# EAGLE design Driver Mosfet (EAGLE 5.08)
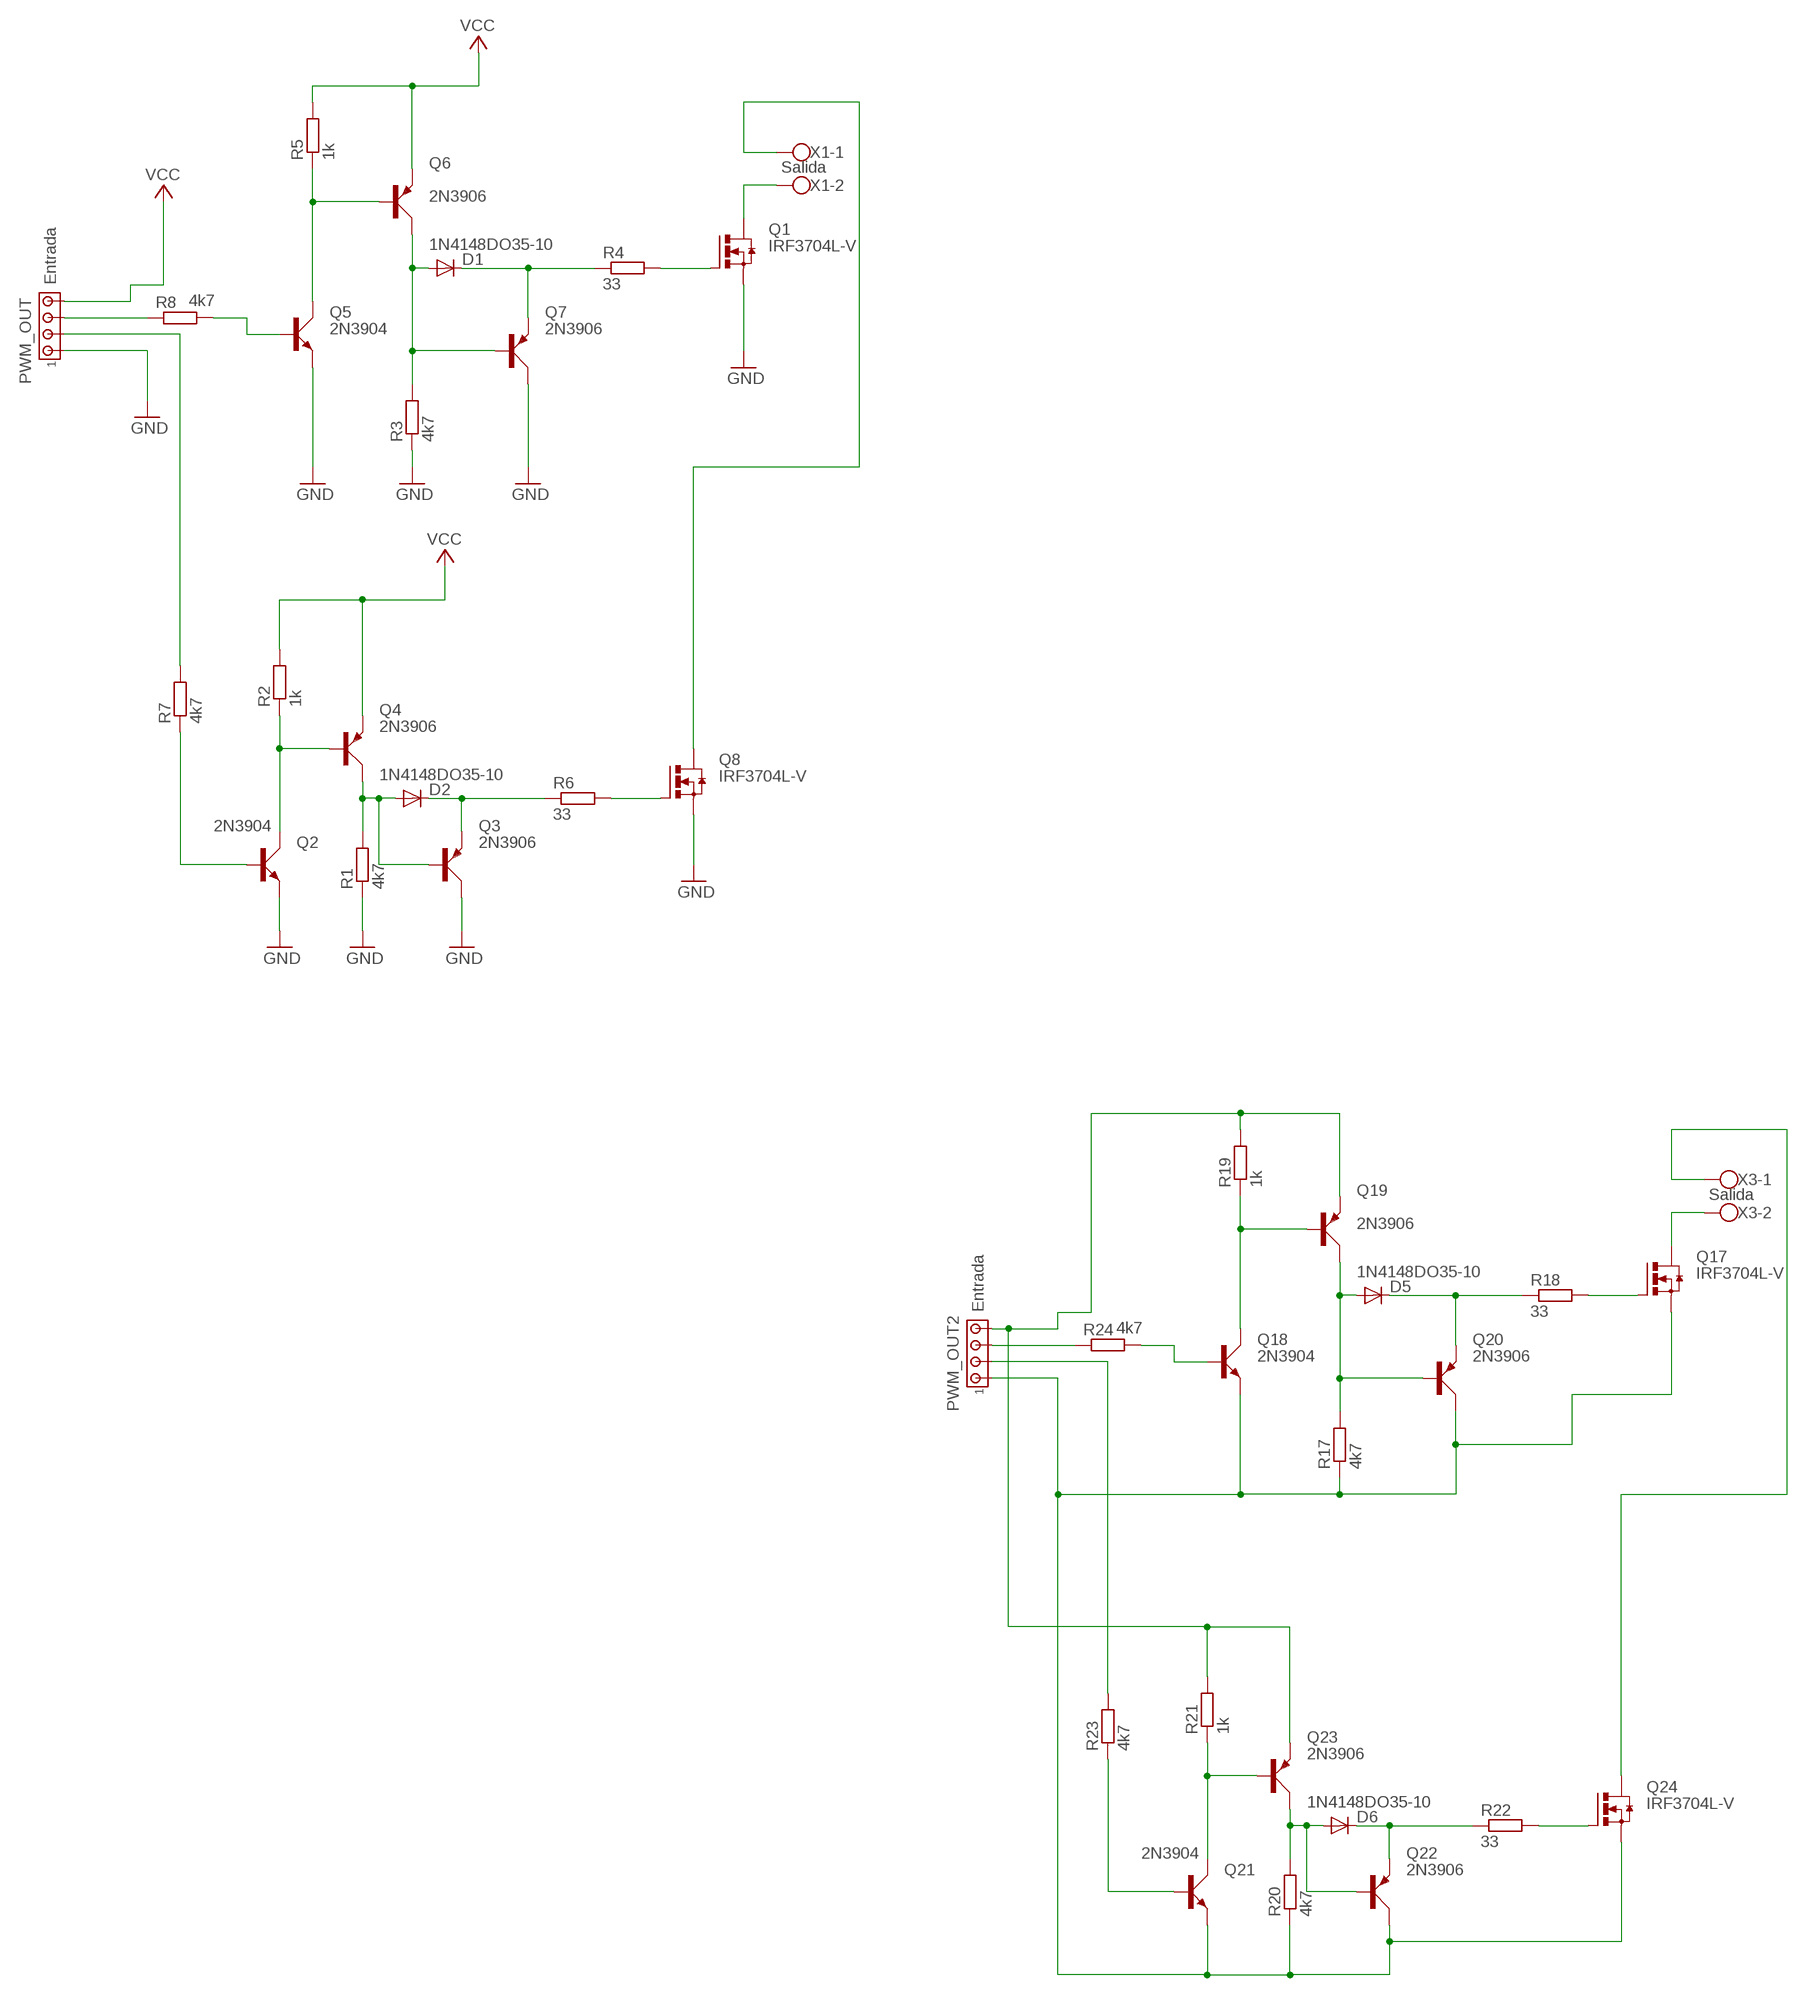
[diagram p0: schematic, sheet 1]

## Parts
D1  1N4148DO35-10  [DO35-10]
D2  1N4148DO35-10  [DO35-10]
D5  1N4148DO35-10  [DO35-10]
D6  1N4148DO35-10  [DO35-10]
PWM_OUT  Entrada  MTA04-100  [10X04MTA]
PWM_OUT2  Entrada  MTA04-100  [10X04MTA]
Q1  IRF3704L-V  [TO262-V]
Q2  2N3904  [TO92D]
Q3  2N3906  [TO92D]
Q4  2N3906  [TO92D]
Q5  2N3904  [TO92D]
Q6  2N3906  [TO92D]
Q7  2N3906  [TO92D]
Q8  IRF3704L-V  [TO262-V]
Q17  IRF3704L-V  [TO262-V]
Q18  2N3904  [TO92D]
Q19  2N3906  [TO92D]
Q20  2N3906  [TO92D]
Q21  2N3904  [TO92D]
Q22  2N3906  [TO92D]
Q23  2N3906  [TO92D]
Q24  IRF3704L-V  [TO262-V]
R1  4k7  R-EU_0207/7  [0207/7]
R2  1k  R-EU_0207/7  [0207/7]
R3  4k7  R-EU_0207/7  [0207/7]
R4  33  R-EU_0207/7  [0207/7]
R5  1k  R-EU_0207/7  [0207/7]
R6  33  R-EU_0207/7  [0207/7]
R7  4k7  R-EU_0207/7  [0207/7]
R8  4k7  R-EU_0207/7  [0207/7]
R17  4k7  R-EU_0207/7  [0207/7]
R18  33  R-EU_0207/7  [0207/7]
R19  1k  R-EU_0207/7  [0207/7]
R20  4k7  R-EU_0207/7  [0207/7]
R21  1k  R-EU_0207/7  [0207/7]
R22  33  R-EU_0207/7  [0207/7]
R23  4k7  R-EU_0207/7  [0207/7]
R24  4k7  R-EU_0207/7  [0207/7]
X1  Salida  W237-02P  [W237-132]
X3  Salida  W237-02P  [W237-132]

## Nets
GND: PWM_OUT.1 Q1.3(S) Q2.E Q3.C Q5.E Q7.C Q8.3(S) R1.1 R3.1
N$1: PWM_OUT.2 R7.2
N$2: Q5.B R8.2
N$3: Q5.C Q6.B R5.1
N$4: D1.A Q6.C Q7.B R3.2
N$5: Q2.C Q4.B R2.1
N$6: D1.C Q7.E R4.1
N$7: Q1.1(G) R4.2
N$8: Q8.2(D) X1.1
N$9: D2.C Q3.E R6.1
N$10: Q8.1(G) R6.2
N$11: Q2.B R7.1
N$12: PWM_OUT.3 R8.1
N$13: D2.A Q3.B Q4.C R1.2
N$14: Q1.2(D) X1.2
N$29: Q18.C Q19.B R19.1
N$30: D5.A Q19.C Q20.B R17.2
N$31: D5.C Q20.E R18.1
N$32: Q17.1(G) R18.2
N$33: Q21.C Q23.B R21.1
N$34: D6.C Q22.E R22.1
N$35: Q24.1(G) R22.2
N$36: PWM_OUT2.2 R23.2
N$37: Q18.B R24.2
N$38: Q21.B R23.1
N$39: PWM_OUT2.3 R24.1
N$40: D6.A Q22.B Q23.C R20.2
N$41: Q24.2(D) X3.1
N$42: Q17.2(D) X3.2
N$45: PWM_OUT2.1 Q17.3(S) Q18.E Q20.C Q21.E Q22.C Q24.3(S) R17.1 R20.1
N$46: PWM_OUT2.4 Q19.E Q23.E R19.2 R21.2
VCC: PWM_OUT.4 Q4.E Q6.E R2.2 R5.2

## Library data of the parts
D1 D2 D5 D6 = diode:1N4148: DIODE high speed (Philips)
PWM_OUT PWM_OUT2 = con-amp:MTA04-100: AMP connector
Q1 Q8 Q17 Q24 = transistor-power:IRF3704: SMPS MOSFET HEXFET® Power MOSFET Source: http://www.irf.com/product-info/datasheets/data/irf3704.pdf
Q2 Q5 Q18 Q21 = transistor-small-signal:2N3904: NPN TRANSISTOR
Q3 Q4 Q6 Q7 Q19 Q20 Q22 Q23 = transistor-small-signal:2N3906: PNP TRANSISTOR
R1-R8 R17-R24 = rcl:R-EU_: RESISTOR, European symbol
X1 X3 = con-wago-508:W237-02P: WAGO SREW CLAMP

## Board
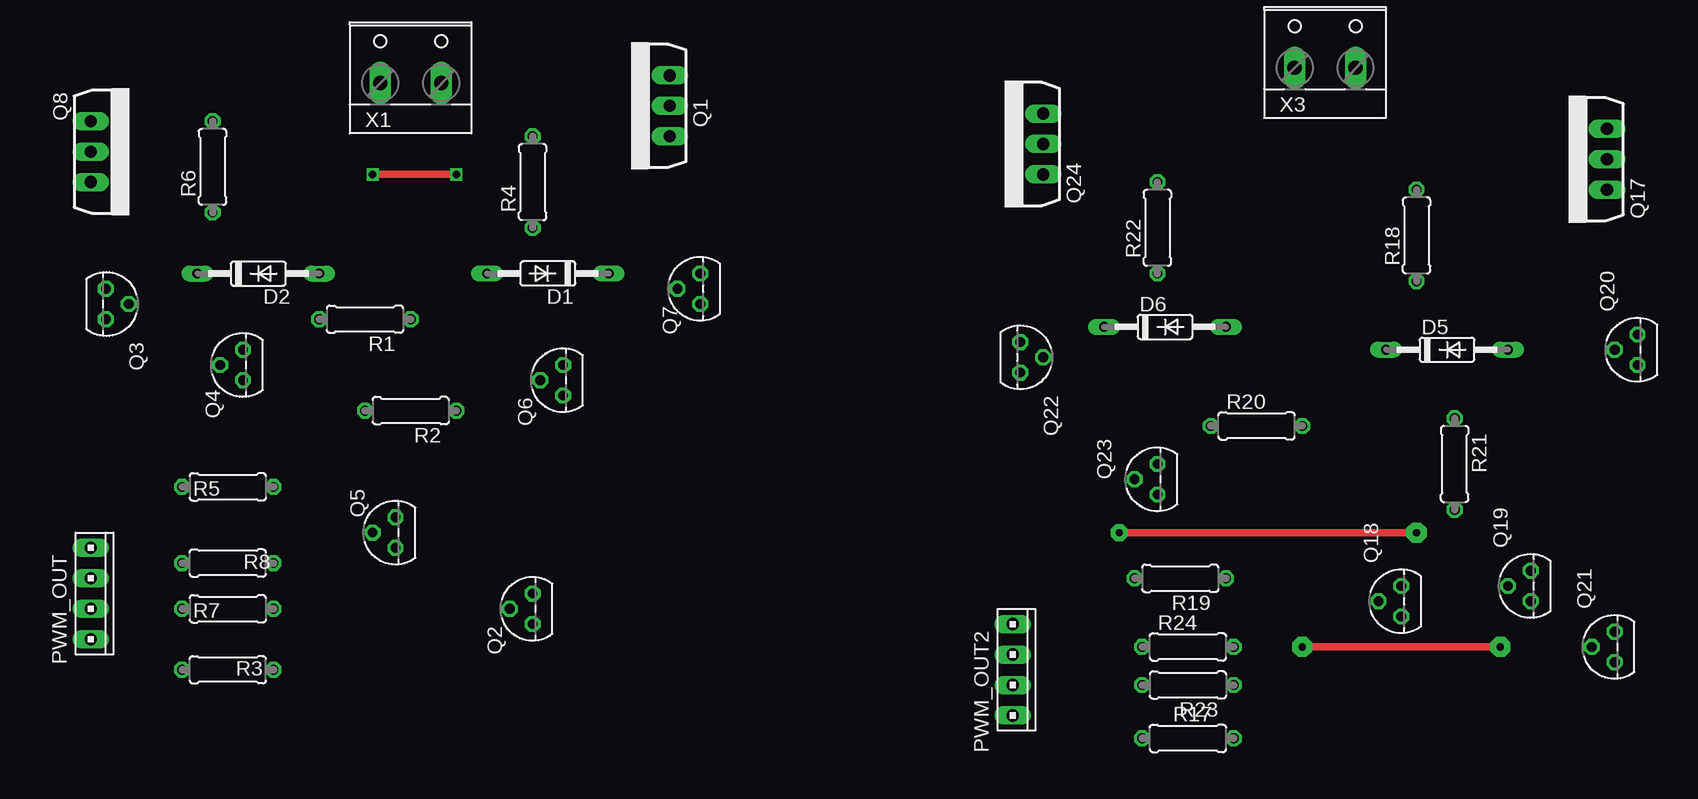
[diagram p1: board, top side]
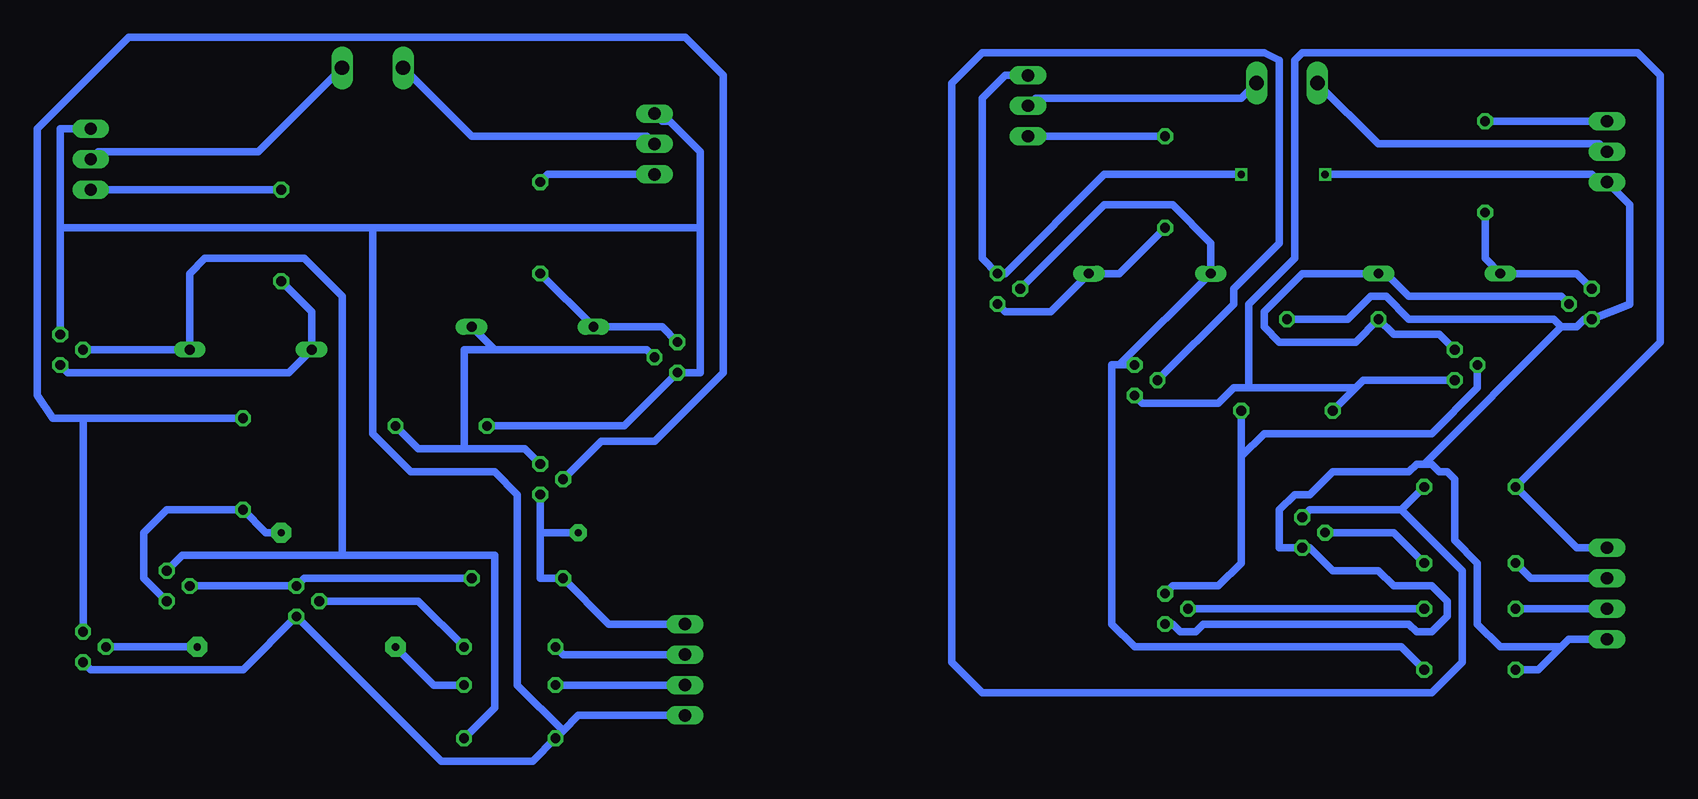
[diagram p2: board, bottom side, seen from below]

No outline drawn. Coordinates in mm, seen from the top.
Copper layers (1*16): Top 0.035mm / dielectric 1.5mm / Bottom 0.035mm
Design rules "Clear 12 Track 24 *": minimum track width 24mil, minimum drill 24mil, track to track 16mil, track to pad 16mil, pad to pad 16mil, via to via 16mil, smd to smd 16mil, copper to edge 40mil, drill to drill 8mil, minimum pad ring 10mil, minimum via ring 8mil, stop-mask expansion 4mil, vias tented up to drill 0mil, thermal gap 10mil

### Footprints (pad centres in the part's own frame; a part is rotated, then mirrored left to right if it is on the bottom)
DO35-10 = drill 0.813 long: A 5.08,0; C -5.08,0
10X04MTA = drill 1.016 long: 1 3.81,0; 2 1.27,0; 3 -1.27,0; 4 -3.81,0
TO262-V = drill 1.016 long: 1 -2.54,0; 2 0,0; 3 2.54,0
TO92D = drill 0.813 octagon: B 0,1.905; C 1.27,0; E -1.27,0
0207/7 = drill 0.813 octagon: 1 -3.81,0; 2 3.81,0
W237-132 = drill 1.194 long: 1 -2.54,-0.635; 2 2.54,-0.635

### Placement (x,y rotation side)
D1  52.07,38.1 180 top
D2  27.94,38.1 0 top
D5  127,31.75 0 top
D6  103.5,33.66 0 top
PWM_OUT  13.97,11.43 270 top
PWM_OUT2  90.81,5.08 270 top
Q1  62.23,52.07 90 top
Q2  50.8,10.16 90 top
Q3  15.24,35.56 270 top
Q4  26.67,30.48 90 top
Q5  39.37,16.51 90 top
Q6  53.34,29.21 90 top
Q7  64.77,36.83 90 top
Q8  13.97,48.26 270 top
Q17  140.34,47.62 90 top
Q18  123.19,10.79 90 top
Q19  133.99,12.06 90 top
Q20  142.88,31.75 90 top
Q21  140.97,6.99 90 top
Q22  91.44,31.11 270 top
Q23  102.87,20.95 90 top
Q24  93.34,48.9 90 top
R1  36.83,34.29 180 top
R2  40.64,26.67 180 top
R3  25.4,5.08 0 top
R4  50.8,45.72 90 top
R5  25.4,20.32 180 top
R6  24.13,46.99 90 top
R7  25.4,10.16 180 top
R8  25.4,13.97 0 top
R17  105.41,-0.64 0 top
R18  124.46,41.27 90 top
R19  104.78,12.7 180 top
R20  111.12,25.4 0 top
R21  127.64,22.23 270 top
R22  102.87,41.91 90 top
R23  105.41,3.81 180 top
R24  105.41,6.99 0 top
X1  40.64,54.61 0 top
X3  116.84,55.88 0 top

### Tracks (layer width: path | path; a pad name or v marks a point on that pad's centre or on a via)
GND  (via drill 0.6)
  Top 0.61: v37.47,46.35 v44.45,46.35
  Bottom 0.61: R1.1 35.56,34.29 33.66,36.2 32.38,36.2 30.48,34.29 18.41,34.29 17.78,33.66 | 17.78,33.66 16.51,33.66 15.88,34.29 Q3.C 12.06,35.56 12.06,43.81 Q8.3 14.61,45.72 15.24,46.35 v37.47,46.35 | PWM_OUT.1 17.14,7.62 17.78,6.99 | 17.78,6.99 19.68,5.08 R3.1 | Q2.E 50.16,8.89 49.53,8.26 48.26,8.26 47.62,8.89 30.48,8.89 29.84,8.26 28.57,8.26 27.3,9.53 27.3,10.79 28.57,12.06 31.75,12.06 33.02,13.34 36.83,13.34 38.73,15.24 Q5.E 41.27,15.24 41.27,18.41 40.01,19.68 38.73,19.68 36.83,21.59 30.48,21.59 29.84,22.23 29.21,22.23 | 17.78,6.99 22.86,6.99 24.77,8.89 24.77,13.97 26.67,15.88 26.67,20.95 27.3,21.59 27.94,21.59 28.57,22.23 29.21,22.23 | 29.21,22.23 17.78,33.66 | Q1.3 64.14,54.61 66.04,52.7 66.04,39.37 Q7.C 64.14,38.1 55.88,46.35 v44.45,46.35
N$1
  Bottom 0.61: PWM_OUT.2 R7.2
N$2
  Bottom 0.61: R8.2 31.75,16.51 Q5.B
N$3
  Bottom 0.61: Q5.C 38.73,18.41 31.11,18.41 | 31.11,18.41 R5.1 | Q6.B 45.09,35.56 45.09,36.83 41.27,40.64 41.27,55.88 42.55,56.52 66.04,56.52 68.58,53.98 68.58,5.71 66.04,3.17 28.57,3.17 26.04,5.71 26.04,13.34 31.11,18.41
N$4
  Bottom 0.61: R3.2 31.11,6.99 53.34,6.99 55.24,8.89 55.24,30.48 54.61,30.48 | 54.61,30.48 Q6.C | 54.61,30.48 D1.A 46.99,40.64 50.16,43.81 55.88,43.81 Q7.B
N$5
  Bottom 0.61: 44.45,22.86 44.45,13.97 46.35,12.06 50.16,12.06 Q2.C | 44.45,22.86 R2.1 | Q4.B 24.77,28.57 28.57,24.77 42.55,24.77 44.45,22.86
N$6
  Bottom 0.61: R4.1 54.61,38.1 D1.C 60.33,34.92 64.14,34.92 Q7.E
N$7
  Bottom 0.61: R4.2 Q1.1
N$8
  Bottom 0.61: Q8.2 14.61,48.9 33.02,48.9 X1.1
N$9
  Bottom 0.61: Q3.E 16.51,38.1 D2.C 24.13,39.37 R6.1
N$10
  Bottom 0.61: Q8.1 R6.2
N$11
  Bottom 0.61: R7.1 Q2.B
N$12
  Bottom 0.61: R8.1 20.32,12.7 PWM_OUT.3
N$13
  Bottom 0.61: Q4.C 27.94,33.02 31.75,33.02 R1.2 34.92,32.38 41.27,32.38 42.55,33.66 42.55,34.92 39.37,38.1 D2.A 32.38,38.1 30.48,36.2 17.78,36.2 Q3.B
N$14
  Bottom 0.61: Q1.2 61.59,52.7 44.45,52.7 X1.2
N$29
  Bottom 0.61: Q19.B Q18.C 122.56,12.7 R19.1
N$30
  Bottom 0.61: Q20.B D5.A 132.08,38.1 130.81,39.37 122.56,39.37 119.38,36.2 119.38,14.61 | R17.2 106.68,1.91 106.68,14.61 119.38,14.61 | 119.38,14.61 132.72,14.61 Q19.C
N$31
  Bottom 0.61: R18.1 121.92,34.92 D5.C 123.83,29.84 142.24,29.84 Q20.E
N$32
  Bottom 0.61: R18.2 Q17.1
N$33
  Bottom 0.61: 140.97,26.04 Q21.C | 140.97,26.04 R21.1 | Q23.B 97.79,24.13 93.34,24.13 87.63,29.84 87.63,54.61 90.81,57.78 137.16,57.78 144.78,50.16 144.78,27.94 143.51,26.04 140.97,26.04
N$34
  Bottom 0.61: Q22.E 92.71,33.66 D6.C R22.1
N$35
  Bottom 0.61: R22.2 102.23,46.35 Q24.1
N$36
  Bottom 0.61: PWM_OUT2.2 R23.2
N$37
  Bottom 0.61: R24.2 113.03,10.79 Q18.B
N$38  (via drill 0.6 pad 1.68)
  Top 0.61: v114.94,6.99 v131.44,6.99
  Bottom 0.61: R23.1 111.76,3.81 v114.94,6.99 | v131.44,6.99 Q21.B
N$39
  Bottom 0.61: R24.1 100.97,6.35 PWM_OUT2.3
N$40
  Bottom 0.61: Q23.C 104.14,23.5 109.22,23.5 | 109.22,23.5 113.03,23.5 R20.2 | Q22.B 93.98,31.75 106.68,31.75 | 106.68,31.75 D6.A | 109.22,23.5 109.22,31.75 106.68,31.75
N$41
  Bottom 0.61: Q24.2 93.98,49.53 108.58,49.53 X3.1
N$42
  Bottom 0.61: Q17.2 139.7,48.26 126.36,48.26 X3.2
N$45
  Bottom 0.61: 100.97,0 99.69,1.27 PWM_OUT2.1 | 100.97,0 R17.1 103.5,-2.54 111.12,-2.54 Q18.E 127.64,5.08 140.34,5.08 Q21.E | 142.88,41.91 142.88,50.16 Q17.3 | 142.88,41.91 Q20.C | R20.1 95.89,25.4 Q22.C 89.53,29.84 89.53,41.91 | Q24.3 92.71,50.8 92.08,50.8 89.53,48.26 89.53,41.91 | 116.84,41.91 89.53,41.91 | 116.84,41.91 142.88,41.91 | 100.97,0 104.78,3.81 104.78,19.68 106.68,21.59 113.67,21.59 116.84,24.77 116.84,41.91
N$46  (via drill 0.6 pad 1.42, 0.6 pad 1.68)
  Top 0.61: v99.69,16.51 v124.46,16.51
  Bottom 0.61: Q19.E 135.89,12.7 135.89,16.51 133.99,18.41 R21.2 125.73,16.51 v124.46,16.51 | PWM_OUT2.4 97.16,8.89 R19.2 102.87,12.7 102.87,16.51 | 102.87,16.51 Q23.E | 102.87,16.51 v99.69,16.51
VCC
  Bottom 0.61: PWM_OUT.4 16.51,15.24 R5.2 9.53,32.38 9.53,54.61 11.43,56.52 39.37,56.52 40.01,55.88 40.01,39.37 43.81,35.56 43.81,28.57 | 34.92,28.57 34.29,29.21 Q4.E | 34.92,28.57 R2.2 | Q6.E 52.7,27.3 46.35,27.3 45.09,28.57 43.81,28.57 | 43.81,28.57 34.92,28.57